# Altium schematic sheet PowerSupply_ZR_OBC.SchDoc
size A4
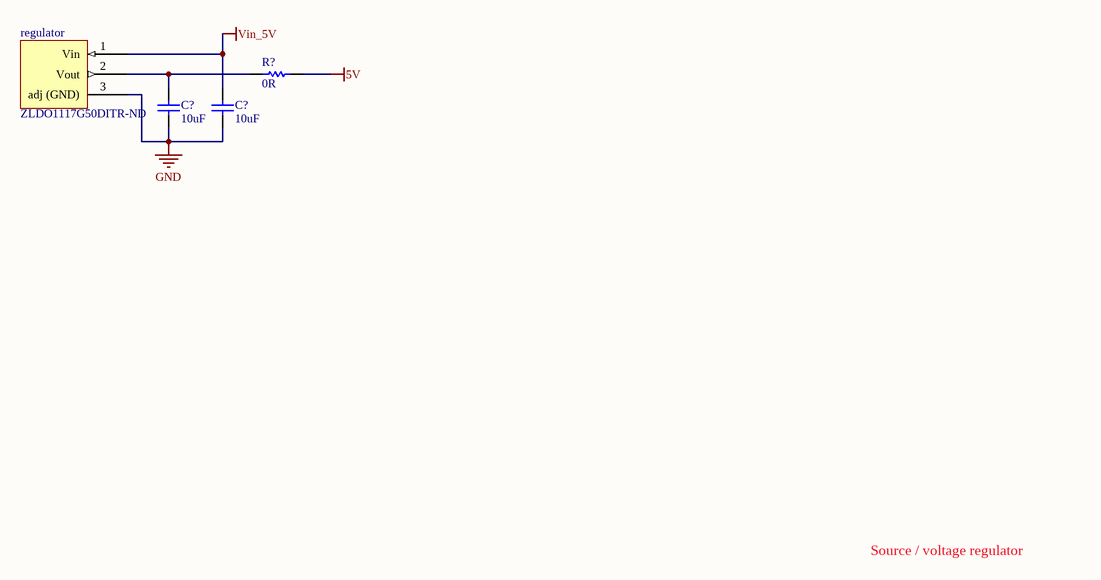
[diagram p0: PowerSupply_ZR_OBC.SchDoc]

## Parts
(Parts that share a designator on the sheet are numbered #1, #2 ... from top to bottom, then left to right.)
C?#1  10uF  [CC1608-0603]
C?#2  10uF  [CC1608-0603]
R?  0R  [CR1608-0603_NP]
regulator  ZLDO1117G50DITR-ND  [regulator]

## Nets
5V: R?.1
GND: C?#1.1 C?#2.1 regulator.3(adj_(GND))
Vin_5V: C?#2.2 regulator.1(Vin)
NetC?#1_2: C?#1.2 R?.2 regulator.2(Vout)

## Notes on the sheet
- Source / voltage regulator

## Library data of the parts
C?#1 C?#2 = Capacitor: eVendor: *; eVendor Price: *; eVendor Part#: *; Manufacturer: *; Part#: *; MOQ: *; MSRP: *; NP: NP
R? = Resistor: eVendor: *; eVendor Price: *; Manufacturer: *; MSRP: *; MOQ: *; Part#: *; NP: NP
regulator = dropout_linear_regulator: Manufacturer: Diodes Incorporated; eVendor: Digikey; eVendeor Price: 0.50000; MSRP: 0.24926; eVendor Part#: ZLDO1117G50DITR-ND; MOQ: 500